# Altium schematic sheet E17-12-VCU-SIC.SchDoc
size A4
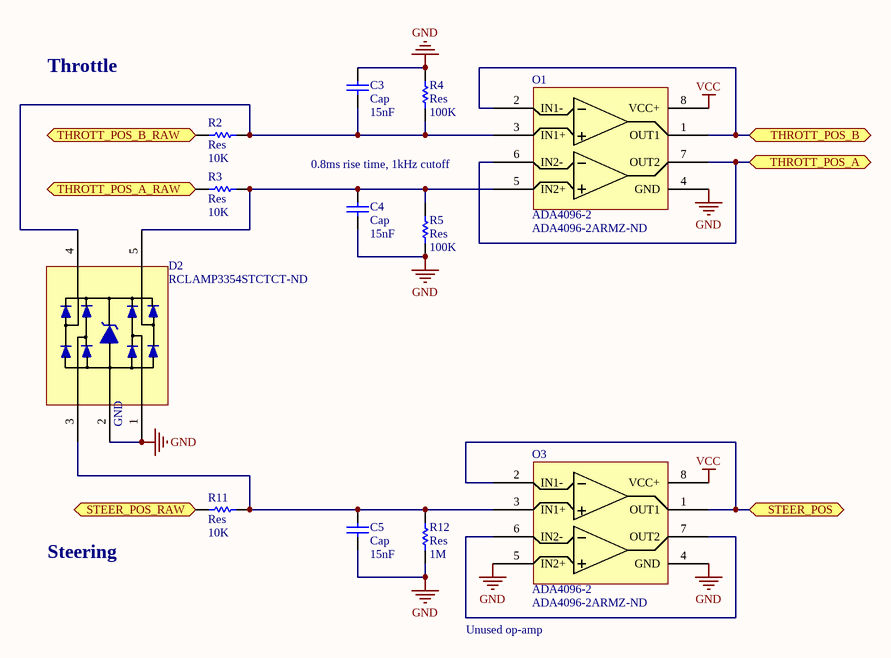
[diagram p0: E17-12-VCU-SIC.SchDoc]

## Parts
C3  Cap  value 15nF  [C0805]
C4  Cap  value 15nF  [C0805]
C5  Cap  value 15nF  [C0805]
D2  Supplier Part Number 1: RCLAMP3354STCTCT-ND  [SOT95P280X145-5N]  (hidden comment: RCLAMP3354S.TCT)
O1  ADA4096-2  Supplier Part Number 1: ADA4096-2ARMZ-ND  [TSSOP8]
O3  ADA4096-2  Supplier Part Number 1: ADA4096-2ARMZ-ND  [TSSOP8]
R2  Res  value 10K  [2012[0805]]
R3  Res  value 10K  [2012[0805]]
R4  Res  value 100K  [2012[0805]]
R5  Res  value 100K  [2012[0805]]
R11  Res  value 10K  [2012[0805]]
R12  Res  value 1M  [2012[0805]]

## Ports
STEER_POS, STEER_POS_RAW, THROTT_POS_A, THROTT_POS_A_RAW, THROTT_POS_B, THROTT_POS_B_RAW

## Nets
GND: C3.1 C4.2 C5.1 D2.1 D2.2(GND) O1.4(GND) O3.4(GND) O3.5(IN2+) R4.2 R5.1 R12.1
VCC: O1.8(VCC+) O3.8(VCC+)
STEER_POS: O3.1(OUT1) O3.2(IN1-) ; port STEER_POS
STEER_POS_RAW: R11.1 ; port STEER_POS_RAW
THROTT_POS_A: O1.6(IN2-) O1.7(OUT2) ; port THROTT_POS_A
THROTT_POS_A_RAW: R3.2 ; port THROTT_POS_A_RAW
THROTT_POS_B: O1.1(OUT1) O1.2(IN1-) ; port THROTT_POS_B
THROTT_POS_B_RAW: R2.2 ; port THROTT_POS_B_RAW
NetC3_2: C3.2 D2.4 O1.3(IN1+) R2.1 R4.1
NetC4_1: C4.1 D2.5 O1.5(IN2+) R3.1 R5.2
NetC5_2: C5.2 D2.3 O3.3(IN1+) R11.2 R12.2
NetO3_6: O3.6(IN2-) O3.7(OUT2)

## Notes on the sheet
- Throttle
- 0.8ms rise time, 1kHz cutoff
- Steering
- Unused op-amp

## Library data of the parts
C3-C5 = Cap: Capacitor; Published: 8-Jun-2000; LatestRevisionDate: 17-Jul-2002; LatestRevisionNote: Re-released for DXP Platform.; PackageReference: C1206; Publisher: Altium Limited
O1 O3 = ADA4096-2: 2 Op-Amps, 8-TSSOP, 32V Overvoltage Protection; Supplier 1: Digi-Key
R2-R5 R11 R12 = Res: Surface Mount Resistor; Published: 8-Jun-2000; LatestRevisionDate: 17-Jul-2002; LatestRevisionNote: Re-released for DXP Platform.; PackageReference: AXIAL-0.5; Publisher: Altium Limited
D2 = RCLAMP3354S.TCT: Supplier 1: Digi-Key